# EAGLE design Central_Unit_PCB (EAGLE 9.6.2)
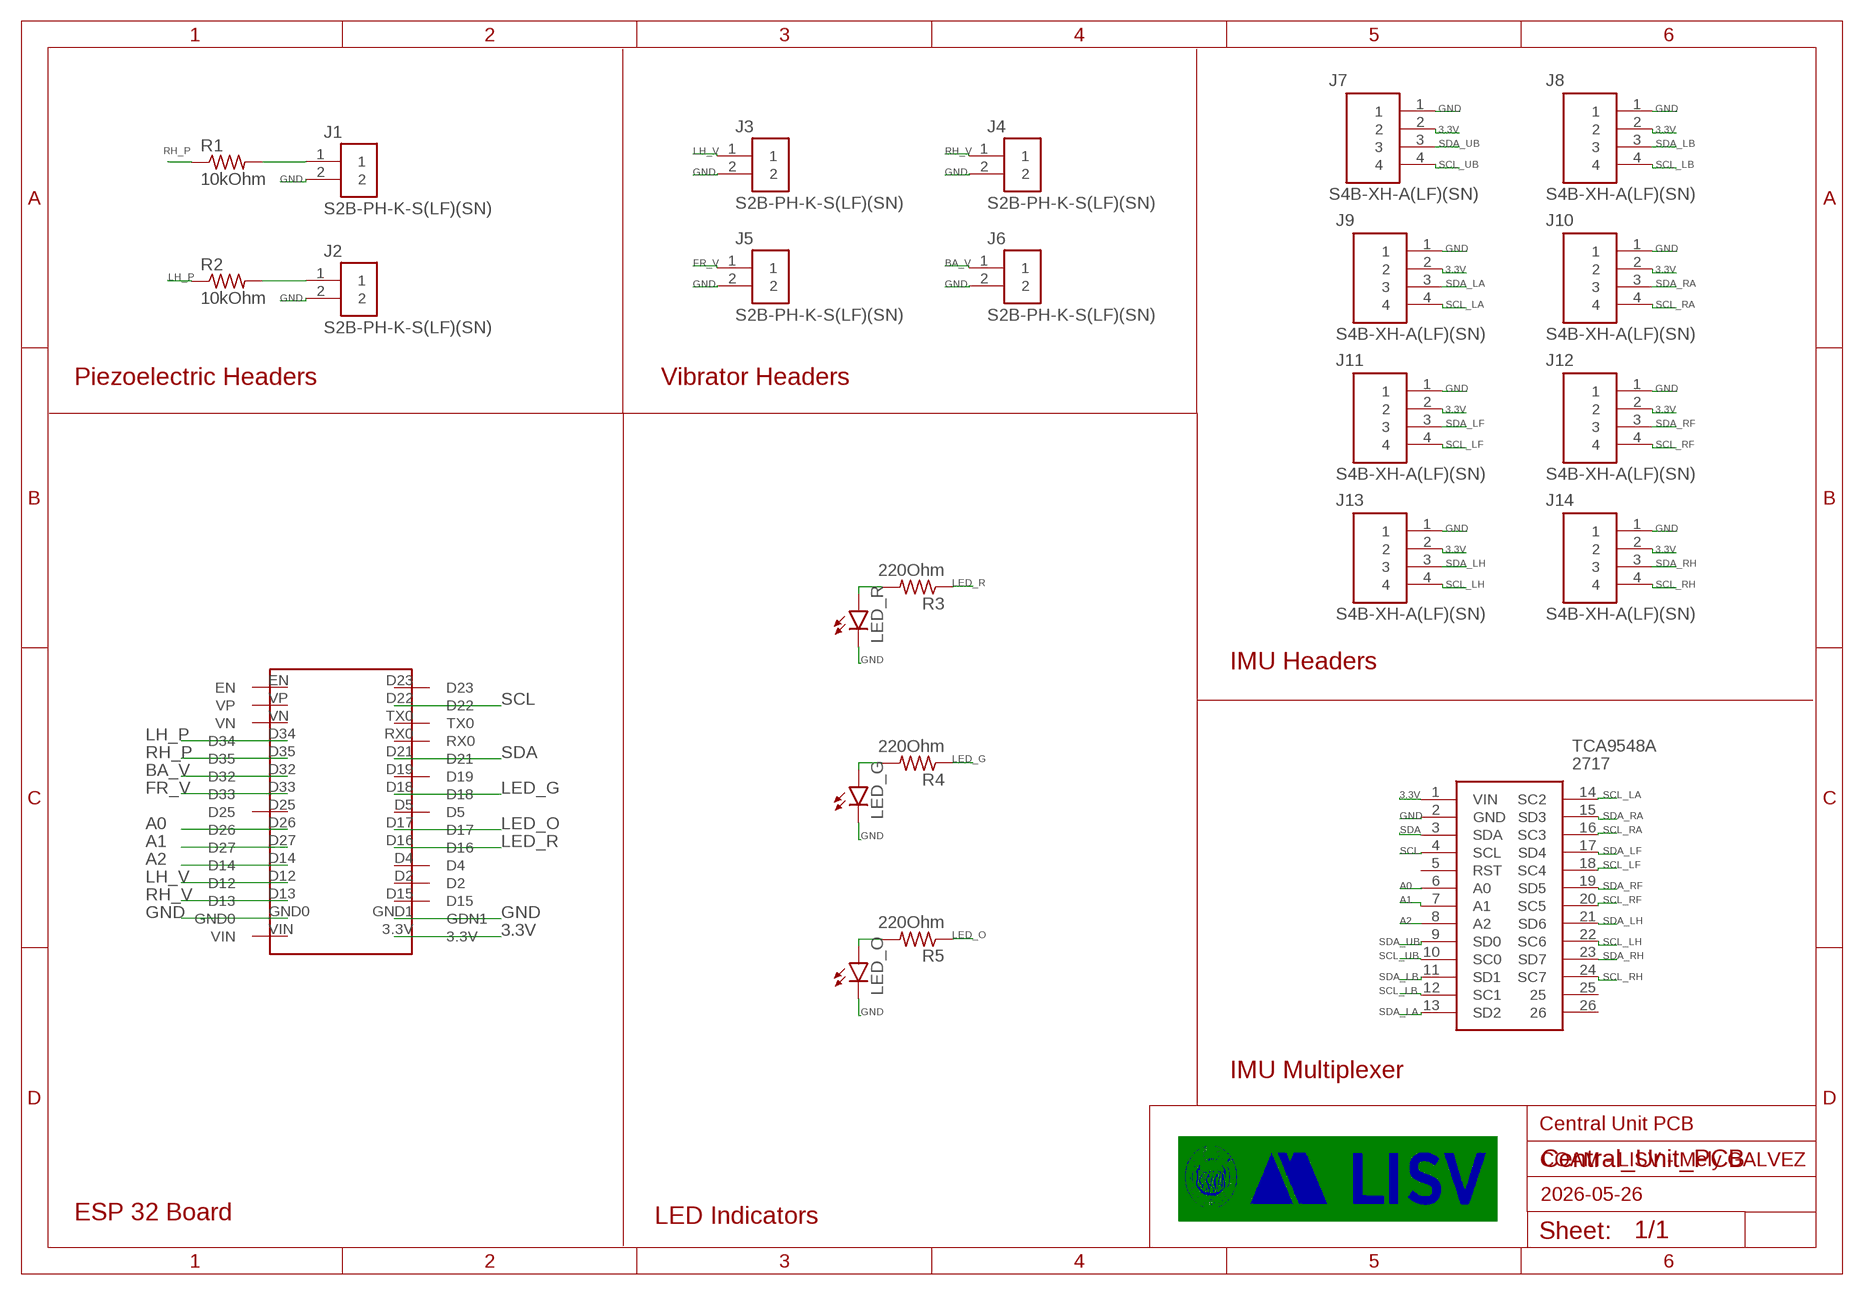
[diagram p0: schematic, sheet 1]

## Parts
J1  S2B-PH-K-S(LF)(SN)  [S2B-PH-K-S(LF)(SN)]
J2  S2B-PH-K-S(LF)(SN)  [S2B-PH-K-S(LF)(SN)]
J3  S2B-PH-K-S(LF)(SN)  [S2B-PH-K-S(LF)(SN)]
J4  S2B-PH-K-S(LF)(SN)  [S2B-PH-K-S(LF)(SN)]
J5  S2B-PH-K-S(LF)(SN)  [S2B-PH-K-S(LF)(SN)]
J6  S2B-PH-K-S(LF)(SN)  [S2B-PH-K-S(LF)(SN)]
J7  S4B-XH-A(LF)(SN)  [HDR-04/RA]
J8  S4B-XH-A(LF)(SN)  [HDR-04/RA]
J9  S4B-XH-A(LF)(SN)  [HDR-04/RA]
J10  S4B-XH-A(LF)(SN)  [HDR-04/RA]
J11  S4B-XH-A(LF)(SN)  [HDR-04/RA]
J12  S4B-XH-A(LF)(SN)  [HDR-04/RA]
J13  S4B-XH-A(LF)(SN)  [HDR-04/RA]
J14  S4B-XH-A(LF)(SN)  [HDR-04/RA]
LED_G  LED3MM  [LED3MM]
LED_O  LED3MM  [LED3MM]
LED_R  LED3MM  [LED3MM]
R1  10kOhm  R-US_0207/10  [0207/10]
R2  10kOhm  R-US_0207/10  [0207/10]
R3  220Ohm  R-US_0207/10  [0207/10]
R4  220Ohm  R-US_0207/10  [0207/10]
R5  220Ohm  R-US_0207/10  [0207/10]
TCA9548A  2717  [2717]
U$1  ESP32_WROUM32  [ESP32_WROUM32]

## Nets
3.3V: J7.2 J8.2 J9.2 J10.2 J11.2 J12.2 J13.2 J14.2 TCA9548A.1(VIN) U$1.3.3V
A0: TCA9548A.6(A0) U$1.D26
A1: TCA9548A.7(A1) U$1.D27
A2: TCA9548A.8(A2) U$1.D14
BA_V: J6.1 U$1.D32
FR_V: J5.1 U$1.D33
GND: J1.2 J2.2 J3.2 J4.2 J5.2 J6.2 J7.1 J8.1 J9.1 J10.1 J11.1 J12.1 J13.1 J14.1 LED_G.K(C) LED_O.K(C) LED_R.K(C) TCA9548A.2(GND) U$1.GND0 U$1.GND1(GDN1)
LED_G: R4.1 U$1.D18
LED_O: R5.1 U$1.D17
LED_R: R3.1 U$1.D16
LH_P: R2.1 U$1.D34
LH_V: J3.1 U$1.D12
N$1: J1.1 R1.2
N$2: J2.1 R2.2
N$3: LED_R.A R3.2
N$4: LED_G.A R4.2
N$5: LED_O.A R5.2
RH_P: R1.1 U$1.D35
RH_V: J4.1 U$1.D13
SCL: TCA9548A.4(SCL) U$1.D22
SCL_LA: J9.4 TCA9548A.14(SC2)
SCL_LB: J8.4 TCA9548A.12(SC1)
SCL_LF: J11.4 TCA9548A.18(SC4)
SCL_LH: J13.4 TCA9548A.22(SC6)
SCL_RA: J10.4 TCA9548A.16(SC3)
SCL_RF: J12.4 TCA9548A.20(SC5)
SCL_RH: J14.4 TCA9548A.24(SC7)
SCL_UB: J7.4 TCA9548A.10(SC0)
SDA: TCA9548A.3(SDA) U$1.D21
SDA_LA: J9.3 TCA9548A.13(SD2)
SDA_LB: J8.3 TCA9548A.11(SD1)
SDA_LF: J11.3 TCA9548A.17(SD4)
SDA_LH: J13.3 TCA9548A.21(SD6)
SDA_RA: J10.3 TCA9548A.15(SD3)
SDA_RF: J12.3 TCA9548A.19(SD5)
SDA_RH: J14.3 TCA9548A.23(SD7)
SDA_UB: J7.3 TCA9548A.9(SD0)
Unconnected: TCA9548A.5(RST) TCA9548A.25 TCA9548A.26 U$1.D2 U$1.D4 U$1.D5 U$1.D15 U$1.D19 U$1.D23 U$1.D25 U$1.EN U$1.RX0 U$1.TX0 U$1.VIN U$1.VN U$1.VP

## Notes on the sheet
- Piezoelectric Headers | Vibrator Headers
- IMU Headers
- IMU Multiplexer
- Central Unit PCB
- COAM - LISV - Mely GALVEZ
- 2026-05-26
- ESP 32 Board | LED Indicators

## Library data of the parts
J1-J6 = Connectors:S2B-PH-K-S(LF)(SN): CONN HEADER R/A 2POS 2MM Manufacturer's datasheet <http://www.jst-mfg.com/product/pdf/eng/ePH.pdf>; CREATED_BY: PCBLayout.com; DIGI_KEY_PART_NUMBER: 455-1719-ND; MANUFACTURER: JST Sales America Inc.; MPN: S2B-PH-K-S(LF)(SN)
J7-J14 = Connectors:S4B-XH-A(LF)(SN): CONN HEADER R/A 4POS 2.5MM Manufacturer's datasheet <http://www.jst-mfg.com/product/pdf/eng/eXH.pdf>; CREATED_BY: PCBLayout.com; DIGIKEY_PART_NUMBER: 455-2243-ND; MANUFACTURER: JST Sales America Inc.; MPN: S4B-XH-A(LF)(SN)
LED_G LED_O LED_R = led:LED: LED OSRAM: - CHIPLED LG R971, LG N971, LY N971, LG Q971, LY Q971, LO R971, LY R971 LH N974, LH R974 LS Q976, LO Q976, LY Q976 LO Q996 - Hyper CHIPLED LW Q18S LB Q993, LB Q99A, LB R99A - SideLED LS A670, LO A670, LY A670, LG A670, LP A670 LB A673, LV A673, LT A673, LW A673 LH A674 LY A675 LS A676, LA A676, LO A676, LY A676, LW A676 LS A679, LY A679, LG A679 - Hyper Micro SIDELED® LS Y876, LA Y876, LO Y876, LY Y876 LT Y87S - SmartLED LW L88C, LW L88S LB L89C, LB L89S, LG L890 LS L89K, LO L89K, LY L89K LS L896, LA L896, LO L896, LY L896 - TOPLED LS T670, LO T670, LY T670, LG T670, LP T670 LSG T670, LSP T670, LSY T670, LOP T670, LYG T670 LG T671, LOG T671, LSG T671 LB T673, LV T673, LT T673, LW T673 LH T674 LS T676, LA T676, LO T676, LY T676, LB T676, LH T676, LSB T676, LW T676 LB T67C, LV T67C, LT T67C, LS T67K, LO T67K, LY T67K, LW E67C LS E67B, LA E67B, LO E67B, LY E67B, LB E67C, LV E67C, LT E67C LW T67C LS T679, LY T679, LG T679 LS T770, LO T770, LY T770, LG T770, LP T770 LB T773, LV T773, LT T773, LW T773 LH T774 LS E675, LA E675, LY E675, LS T675 LS T776, LA T776, LO T776, LY T776, LB T776 LHGB T686 LT T68C, LB T68C - Hyper Mini TOPLED® LB M676 - Mini TOPLED Santana® LG M470 LS M47K, LO M47K, LY M47K Source: http://www.osram.convergy.de LUXEON: - LUMILED® LXK2-PW12-R00, LXK2-PW12-S00, LXK2-PW14-U00, LXK2-PW14-V00 LXK2-PM12-R00, LXK2-PM12-S00, LXK2-PM14-U00 LXK2-PE12-Q00, LXK2-PE12-R00, LXK2-PE12-S00, LXK2-PE14-T00, LXK2-PE14-U00 LXK2-PB12-K00, LXK2-PB12-L00, LXK2-PB12-M00, LXK2-PB14-N00, LXK2-PB14-P00, LXK2-PB14-Q00 LXK2-PR12-L00, LXK2-PR12-M00, LXK2-PR14-Q00, LXK2-PR14-R00 LXK2-PD12-Q00, LXK2-PD12-R00, LXK2-PD12-S00 LXK2-PH12-R00, LXK2-PH12-S00 LXK2-PL12-P00, LXK2-PL12-Q00, LXK2-PL12-R00 Source: www.luxeon.com KINGBRIGHT: KA-3528ASYC Source: www.kingbright.com
R1-R5 = adafruit:R-US_: RESISTOR, American symbol
TCA9548A = TCA9548A_m:2717: Switch IC Development Tools TCA9548A I2C Multiplexer Source: Datasheet <https://learn.adafruit.com/downloads/pdf/adafruit-tca9548a-1-to-8-i2c-multiplexer-breakout.pdf>; DESCRIPTION: Switch IC Development Tools TCA9548A I2C Multiplexer; HEIGHT: 1mm; MANUFACTURER_NAME: Adafruit; MANUFACTURER_PART_NUMBER: 2717; MOUSER_PART_NUMBER: 485-2717; MOUSER_PRICE-STOCK: https://www.mouser.com/Search/Refine.aspx?Keyword=485-2717
U$1 = ESP32_WROUM32:ESP32_WROUM32

## Board
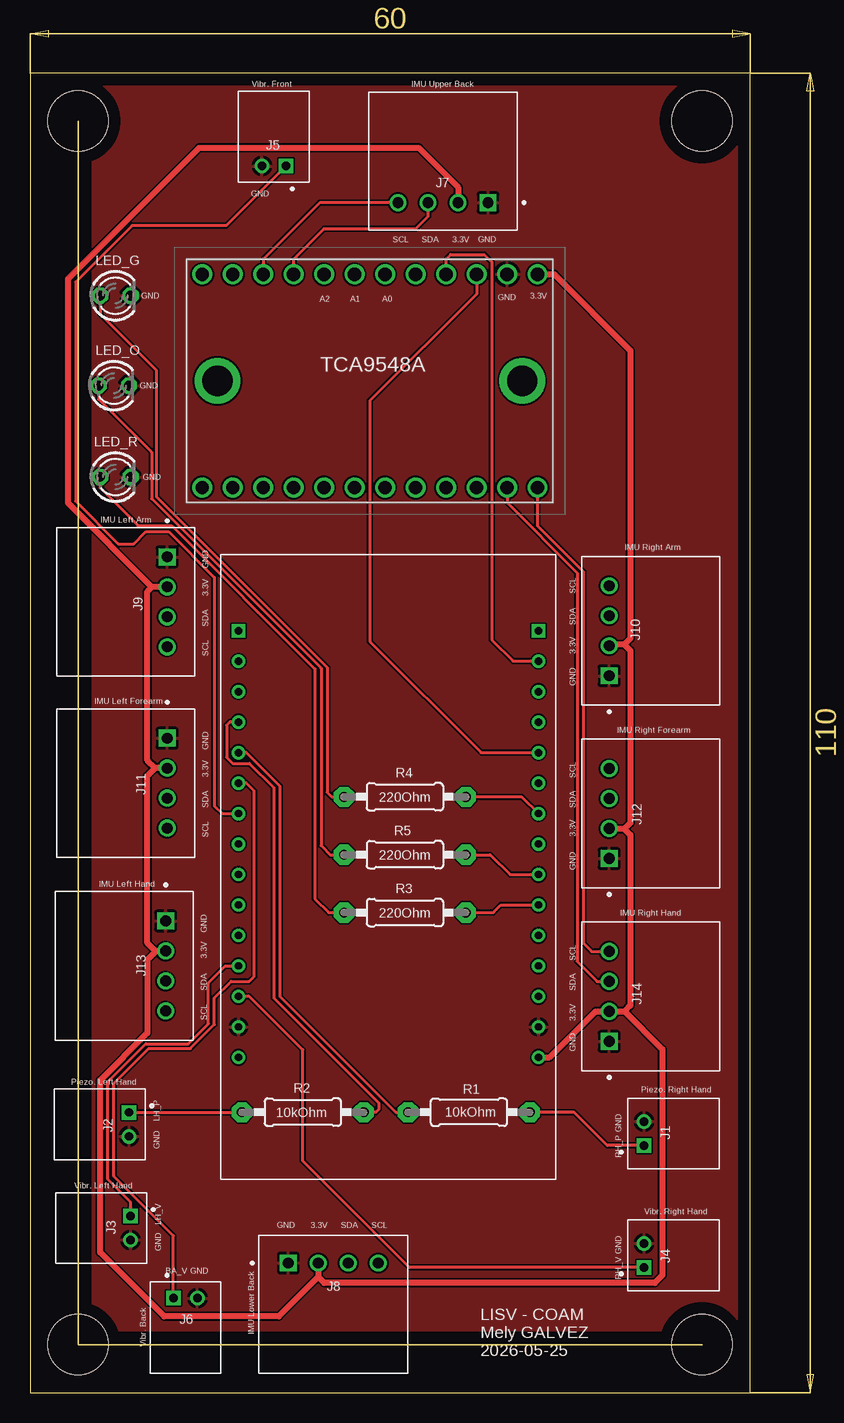
[diagram p1: board, top side]
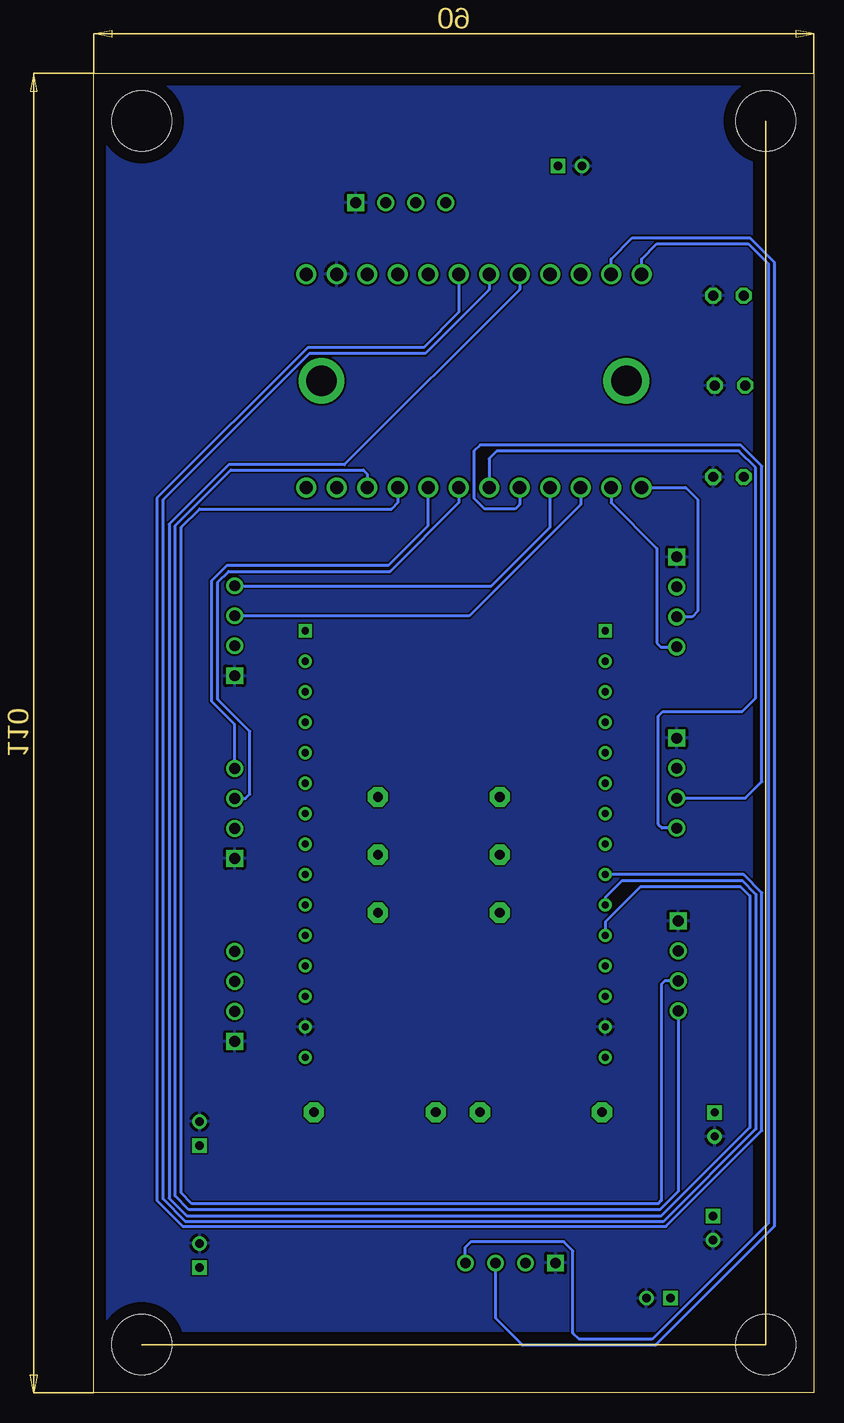
[diagram p2: board, bottom side, seen from below]

Size 60 x 110 mm. Coordinates in mm from the lower left corner, seen from the top.
Outline: 0,0 60,0 60,110 0,110 0,0
Copper layers (1*16): Top 0.035mm / dielectric 1.5mm / Bottom 0.035mm
Design rules "default": minimum track width 6mil, minimum drill 0.35mm, track to track 6mil, track to pad 6mil, pad to pad 6mil, via to via 6mil, smd to smd 6mil, copper to edge 40mil, drill to drill 6mil, minimum pad ring 10mil, minimum via ring 8mil, stop-mask expansion 4mil, vias tented up to drill 0mil, thermal gap 10mil
Holes 5 mm at 4,4 56,4 4,106 56,106

### Footprints (pad centres in the part's own frame; a part is rotated, then mirrored left to right if it is on the bottom)
S2B-PH-K-S(LF)(SN) = drill 0.7 square: 1 -1,0 | drill 0.7: 2 1,0
HDR-04/RA = drill 0.9 square: 1 -3.75,0 | drill 0.9: 2 -1.25,0; 3 1.25,0; 4 3.75,0
LED3MM = drill 0.813 octagon: A -1.27,0; K 1.27,0
0207/10 = drill 0.813 pad 1.676 octagon: 1 -5.08,0; 2 5.08,0
2717 = drill 1.11 pad 1.665: 1 -7.62,13.97; 2 -7.62,11.43; 3 -7.62,8.89; 4 -7.62,6.35; 5 -7.62,3.81; 6 -7.62,1.27; 7 -7.62,-1.27; 8 -7.62,-3.81; 9 -7.62,-6.35; 10 -7.62,-8.89; 11 -7.62,-11.43; 12 -7.62,-13.97; 13 10.16,-13.97; 14 10.16,-11.43; 15 10.16,-8.89; 16 10.16,-6.35; 17 10.16,-3.81; 18 10.16,-1.27; 19 10.16,1.27; 20 10.16,3.81; 21 10.16,6.35; 22 10.16,8.89; 23 10.16,11.43; 24 10.16,13.97 | drill 2.54 pad 3.81: 25 1.27,12.7; 26 1.27,-12.7
ESP32_WROUM32 = drill 0.6: 3.3V 26.5,10.16; D2 26.5,17.78; D4 26.5,20.32; D5 26.5,27.94; D12 1.5,17.78; D13 1.5,15.24; D14 1.5,20.32; D15 26.5,15.24; D16 26.5,22.86; D17 26.5,25.4; D18 26.5,30.48; D19 26.5,33.02; D21 26.5,35.56; D22 26.5,43.18; D25 1.5,27.94; D26 1.5,25.4; D27 1.5,22.86; D32 1.5,33.02; D33 1.5,30.48; D34 1.5,38.1; D35 1.5,35.56; GND0 1.5,12.7; GND1 26.5,12.7; RX0 26.5,38.1; TX0 26.5,40.64; VIN 1.5,10.16; VN 1.5,40.64; VP 1.5,43.18 | drill 0.6 square: D23 26.5,45.72; EN 1.5,45.72

### Placement (x,y rotation side)
J1  51.18,21.59 90 top
J2  8.26,22.35 270 top
J3  8.38,13.72 270 top
J4  51.18,11.43 90 top
J5  20.32,102.23 180 top
J6  12.95,7.87 0 top
J7  34.42,99.19 180 top
J8  25.27,10.79 0 top
J9  11.43,65.91 270 top
J10  48.26,63.5 90 top
J11  11.43,50.8 270 top
J12  48.26,48.26 90 top
J13  11.3,35.56 270 top
J14  48.26,33.02 90 top
LED_G  7.11,91.44 0 top
LED_O  6.99,83.95 0 top
LED_R  7.11,76.33 0 top
R1  36.58,23.37 0 top
R2  22.73,23.37 180 top
R3  31.24,40.01 180 top
R4  31.24,49.66 180 top
R5  31.24,44.83 180 top
TCA9548A  28.32,85.6 270 top
U$1  15.88,17.78 0 top

### Tracks (layer width: path | path; a pad name or v marks a point on that pad's centre or on a via)
3.3V
  Top 0.25: 48.37,62.36 J10.2 | J13.2 10.43,36.81 | 48.28,46.99 J12.2
  Top 0.5: TCA9548A.1 43.69,93.22 50.04,86.87 50.04,62.87 49.53,62.36 | 49.53,62.36 48.37,62.36 | 49.53,62.36 50.04,61.85 50.04,47.5 49.53,46.99 | J8.2 24.02,9.63 | 24.02,9.63 24.51,9.14 52.07,9.14 52.7,9.78 52.7,28.61 49.55,31.77 | 24.02,9.63 20.74,6.35 11.18,6.35 5.84,11.68 5.84,26.04 9.78,29.97 9.78,36.07 10.52,36.81 J13.2 | J7.2 35.67,100.48 32.38,103.76 14.1,103.76 3.17,92.84 3.17,74.15 10.16,67.16 | U$1.3.3V 43.31,27.94 47.14,31.77 J14.2 49.55,31.77 | J9.2 10.16,67.16 | 10.16,67.16 9.78,66.78 9.78,52.7 10.43,52.05 | J11.2 10.43,52.05 | 10.43,52.05 9.78,51.4 9.78,37.47 10.43,36.81 | 49.53,46.99 48.28,46.99 | 49.53,46.99 50.04,46.48 50.04,32.26 49.55,31.77
A0
  Bottom 0.25: TCA9548A.6 29.59,90.04 32.51,87.12 42.16,87.12 54.74,74.55 54.74,16 52.58,13.84 12.32,13.84 4.32,21.84 4.32,41.66 5.84,43.18 U$1.D26
A1
  Bottom 0.25: TCA9548A.7 27.05,91.95 32.38,86.61 42.04,86.61 54.23,74.42 54.23,16.13 52.34,14.24 12.55,14.24 4.83,21.97 4.83,41.53 5.97,42.67 15.98,42.67 17.38,41.27 U$1.D27
A2
  Bottom 0.25: TCA9548A.8 24.51,91.95 39.12,77.34 48.77,77.34 53.72,72.39 53.72,16.2 52.26,14.73 12.7,14.73 5.33,22.1 5.33,41.4 6.1,42.16 14.45,42.16 17.38,39.24 U$1.D14
BA_V
  Top 0.25: J6.1 11.95,13.06 6.99,18.03 6.99,25.78 9.88,28.68 13.38,28.68 15.37,30.67 15.37,32.89 16.76,34.29 18.29,34.29 18.67,34.67 18.67,50.16 18.03,50.8 U$1.D32
FR_V
  Top 0.25: J5.1 16.37,97.28 8.51,97.28 3.81,92.58 3.81,74.3 7.37,70.74 8.64,70.74 9.65,71.75 11.56,71.75 15.37,67.94 15.37,48.9 16,48.26 U$1.D33
GND
  pour Bottom: 0,110 60,110 60,0 0,0
  pour Top: 0,0 60,0 60,110 0,110
LED_G
  Top 0.25: R4.1 40.98,49.66 U$1.D18
LED_O
  Top 0.25: R5.1 38.35,44.83 40.01,43.18 U$1.D17
LED_R
  Top 0.25: R3.1 38.61,40.01 39.24,40.64 U$1.D16
LH_P
  Top 0.25: U$1.D34 16.64,55.88 16.38,55.63 16.38,52.96 16.89,52.45 18.29,52.45 20.32,50.42 20.32,32.89 29.08,24.13 29.08,23.62 28.83,23.37 R2.1
LH_V
  Top 0.25: J3.1 8.38,15.88 6.48,17.78 6.48,25.91 9.65,29.08 13.21,29.08 14.86,30.73 14.86,34.16 16.26,35.56 U$1.D12
N$1
  Top 0.25: J1.1 48.12,20.59 45.34,23.37 R1.2
N$2
  Top 0.25: J2.1 17.64,23.35 R2.2
N$3
  Top 0.25: LED_R.A 5.84,75.44 9.02,72.26 11.81,72.26 23.75,60.33 23.75,41.15 24.89,40.01 R3.2
N$4
  Top 0.25: LED_G.A 5.84,89.92 10.54,85.22 10.54,74.68 24.77,60.45 24.77,50.04 25.15,49.66 R4.2
N$5
  Top 0.25: LED_O.A 5.71,82.8 10.14,78.38 10.14,74.51 24.26,60.39 24.26,45.59 25.02,44.83 R5.2
RH_P
  Top 0.25: U$1.D35 18.03,53.34 20.83,50.55 20.83,33.02 30.48,23.37 R1.1
RH_V
  Top 0.25: J4.1 31.61,10.43 22.73,19.3 22.73,28.57 18.29,33.02 U$1.D13
SCL
  Top 0.25: TCA9548A.4 34.67,94.49 35.05,94.87 37.85,94.87 38.48,94.23 38.48,62.74 40.26,60.96 U$1.D22
SCL_LA
  Bottom 0.25: J9.4 12.76,62.16 13.08,62.48 13.08,70.36 16.89,74.17 TCA9548A.14
SCL_LB
  Bottom 0.25: TCA9548A.12 14.35,94.49 13.08,95.76 5.46,95.76 3.81,94.11 3.81,14.1 13.46,4.45 19.56,4.45 20.07,4.95 20.07,11.81 20.83,12.57 28.57,12.57 29.08,12.06 29.08,10.86 J8.4
SCL_LF
  Bottom 0.25: J11.4 12.63,47.05 12.95,47.37 12.95,56.39 12.57,56.77 5.97,56.77 4.85,57.89 4.85,77.09 6.24,78.49 26.42,78.49 27.05,77.85 TCA9548A.18
SCL_LH
  Bottom 0.25: J13.4 11.3,16.76 12.83,15.24 52.07,15.24 53.21,16.38 53.21,72.26 48.58,76.9 37.53,76.9 37.21,76.58 TCA9548A.22
SCL_RA
  Bottom 0.25: J10.4 26.86,67.25 21.97,72.14 TCA9548A.16
SCL_RF
  Bottom 0.25: J12.4 48.26,55.69 50.16,57.6 50.16,67.69 48.9,68.96 35.43,68.96 32.13,72.26 TCA9548A.20
SCL_RH
  Top 0.25: TCA9548A.24 42.29,72.26 46.1,68.45 46.1,37.47 46.8,36.77 J14.4
SCL_UB
  Top 0.25: J7.4 24.13,99.19 19.43,94.49 TCA9548A.10
SDA
  Top 0.25: TCA9548A.3 37.21,91.57 28.32,82.68 28.32,62.61 37.59,53.34 U$1.D21
SDA_LA
  Bottom 0.25: TCA9548A.13 10.68,75.44 10.68,75.45 9.65,74.42 9.65,65.15 10.14,64.66 J9.3
SDA_LB
  Bottom 0.25: TCA9548A.11 16.89,94.49 15.11,96.27 5.33,96.27 3.3,94.23 3.3,13.84 13.21,3.94 24.26,3.94 26.52,6.2 J8.3
SDA_LF
  Bottom 0.25: J11.3 5.7,49.55 4.32,50.93 4.32,77.22 6.1,78.99 27.81,78.99 28.32,78.49 28.32,74.55 27.43,73.66 24.89,73.66 24.51,74.04 TCA9548A.17
SDA_LH
  Bottom 0.25: J13.3 12.43,34.31 12.7,34.04 12.7,16 12.95,15.75 51.82,15.75 52.7,16.64 52.7,72.14 51.18,73.66 35.18,73.66 34.67,74.17 TCA9548A.21
SDA_RA
  Bottom 0.25: TCA9548A.15 19.43,74.04 28.72,64.75 J10.3
SDA_RF
  Bottom 0.25: J12.3 47.37,49.51 46.99,49.89 46.99,55.12 49.66,57.78 49.66,67.56 48.77,68.45 35.31,68.45 29.59,74.17 TCA9548A.19
SDA_RH
  Top 0.25: TCA9548A.23 39.75,74.17 45.59,68.33 45.59,35.94 47.26,34.27 J14.3
SDA_UB
  Top 0.25: TCA9548A.9 21.97,94.49 24.51,97.03 32.15,97.03 33.17,98.04 J7.3

### Text on the board
tNames: Vibr. Front | IMU Upper Back | GND | SCL | SDA | 3.3V | GND | GND | GND | A2 | A1 | A0 | 3.3V | GND | GND | IMU Left Arm | GND | IMU Right Arm | 3.3V | SCL | SDA | SDA | SCL | 3.3V | GND | IMU Left Forearm | GND | IMU Right Forearm | 3.3V | SCL | SDA | SDA | SCL | 3.3V | GND | IMU Left Hand | GND | IMU Right Hand | 3.3V | SCL | SDA | SDA | SCL | 3.3V | GND | Piezo. Left Hand | Piezo. Right Hand | LH_P | GND | GND | RH_P | Vibr. Left Hand | LH_V | Vibr. Right Hand | GND | 3.3V | SDA | SCL | GND | GND | RH_V | BA_V | GND | IMU Lower Back | Vibr. Back | LISV - COAM / Mely GALVEZ / 2026-05-25